# Altium project Do_An_2.PrjPcb
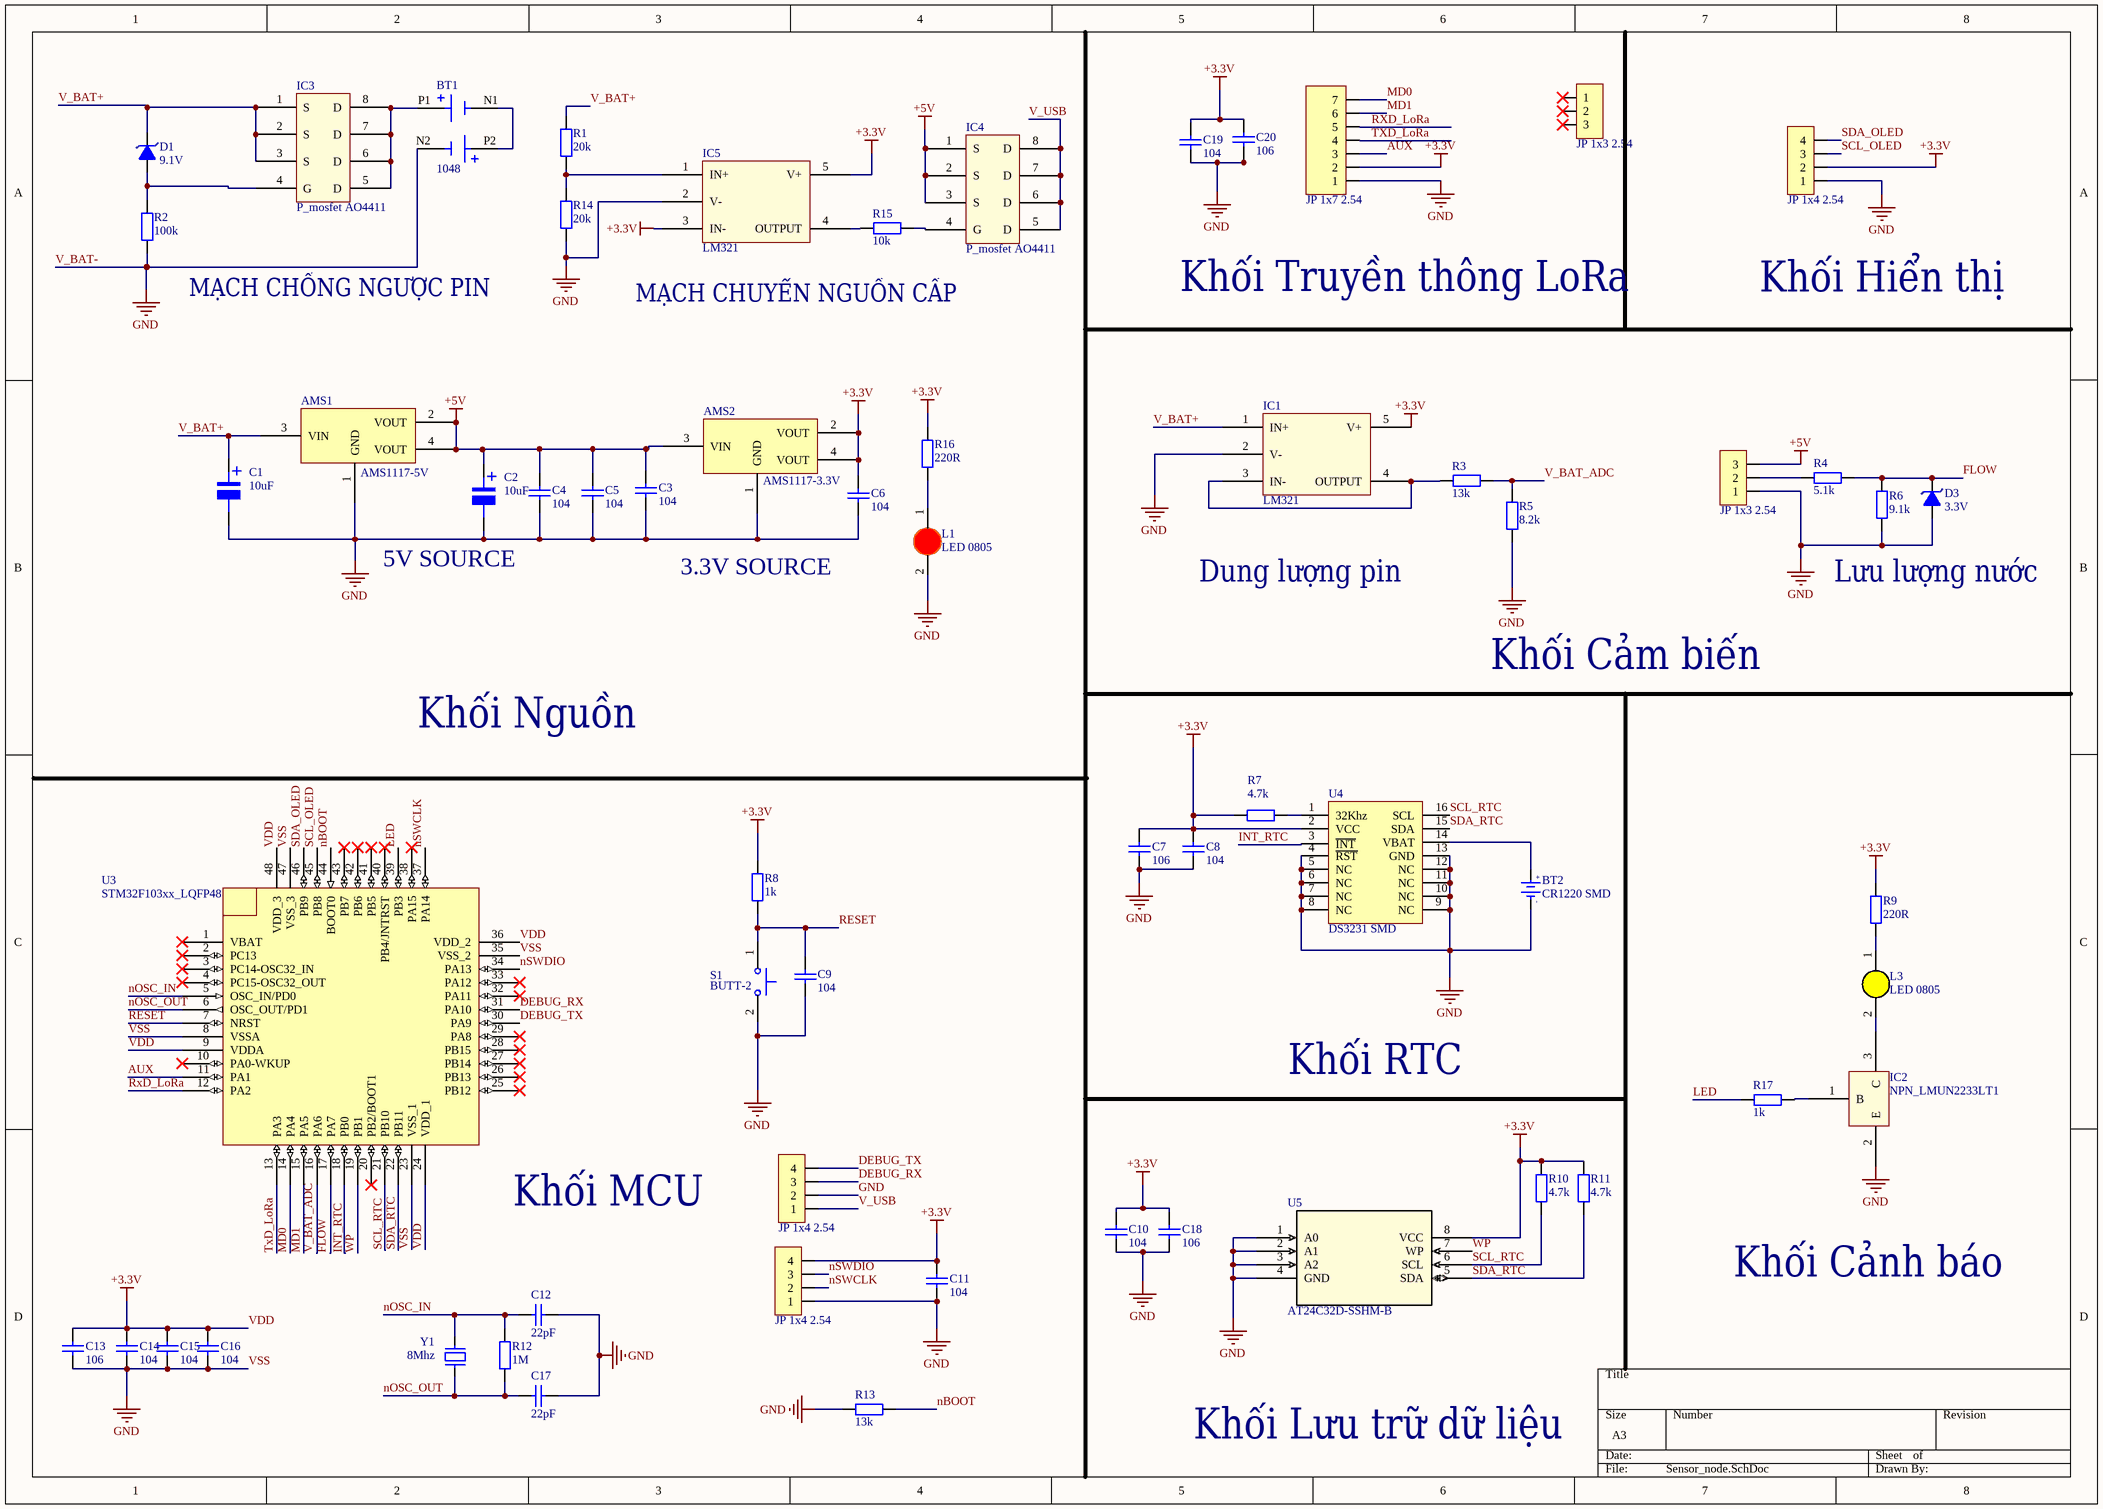
[diagram p0: Sensor_node.SchDoc]
1 sheet, 61 parts. Net scope: global (net labels, ports and power ports of the same name join across sheets).
Board file: Sensor_node.PcbDoc

## Sheet Sensor_node.SchDoc
size A3; SheetNumber: 1; SheetTotal: 1

### Parts
AMS1  AMS1117-5V  [SOT223]
AMS2  AMS1117-3.3V  [SOT223]
BT1  1048  [BAT_1048]
BT2  CR1220 SMD  [DE PIN CR1220]
C1  10uF  [tu nhom 4 (b)]
C2  10uF  [tu nhom 4 (b)]
C3  104  [tu 1206]
C4  104  [tu 1206]
C5  104  [tu 1206]
C6  104  [tu 1206]
C7  106  [tu 1206]
C8  104  [tu 1206]
C9  104  [tu 1206]
C10  104  [tu 1206]
C11  104  [tu 1206]
C12  22pF  [tu 0805]
C13  106  [tu 1206]
C14  104  [tu 1206]
C15  104  [tu 1206]
C16  104  [tu 1206]
C17  22pF  [tu 0805]
C18  106  [tu 1206]
C19  104  [tu 1206]
C20  106  [tu 1206]
D1  9.1V  [DIODE ZENNER SMD SOD80]
D3  3.3V  [DIODE ZENNER SMD SOD80]
IC1  LM321  [SOT23_LM321]
IC2  NPN_LMUN2233LT1  [SOT23_LMUN2233_trans]
IC3  P_mosfet AO4411  [SOIC8_AO4411]
IC4  P_mosfet AO4411  [SOIC8_AO4411]
IC5  LM321  [SOT23_LM321]
JP1  JP 1x7 2.54  [JP 1x7 CT]
JP2  JP 1x3 2.54  [JP 1x3 CT]
JP3  JP 1x4 2.54  [JP 1x4 CT]
JP4  JP 1x3 2.54  [JP 1x3 DC]
JP5  JP 1x4 2.54  [JP 1x4 DC]
JP6  JP 1x4 2.54  [JP 1x4 DC]
L1  LED 0805  [LED-0805-Red]
L3  LED 0805  [LED-0805-Yellow]
R1  20k  [tro smd 1206]
R2  100k  [tro smd 0805]
R3  13k  [tro smd 0805]
R4  5.1k  [tro smd 0805]
R5  8.2k  [tro smd 0805]
R6  9.1k  [tro smd 0805]
R7  4.7k  [tro smd 0805]
R8  1k  [tro smd 0805]
R9  220R  [tro smd 0805]
R10  4.7k  [tro smd 0805]
R11  4.7k  [tro smd 0805]
R12  1M  [tro smd 0805]
R13  13k  [tro smd 0805]
R14  20k  [tro smd 1206]
R15  10k  [tro smd 1206]
R16  220R  [tro smd 0805]
R17  1k  [tro smd 1206]
S1  BUTT-2  [SW_BUTT-2]
U3  STM32F103xx_LQFP48  [STM32_LQPF48]
U4  DS3231 SMD  [SOIC 16]
U5  AT24C32D-SSHM-B  [8S1_ATM]
Y1  8Mhz  [Thach Anh 2 chan SMD]

### Nets
+5V: AMS1.2(VOUT) AMS1.4(VOUT) AMS2.3(VIN) C2.1 C3.1 C4.1 C5.1 IC4.1(S) IC4.2(S) IC4.3(S) JP4.3
GND: AMS1.1(GND) AMS2.1(GND) BT1.N2 BT2.2(GND) C1.2 C2.2 C3.2 C4.2 C5.2 C6.2 C7.1 C8.2 C9.2 C10.2 C11.2 C12.1 C13.1 C14.2 C15.2 C16.2 C17.1 C18.2 C19.2 C20.2 D3.1(A) IC1.2(V-) IC2.2(E) IC5.2(V-) JP1.1 JP3.1 JP4.1 JP5.1 JP6.2 L1.2(K) R2.1 R5.1 R6.1 R13.1 R14.1 S1.2 U3.8(VSSA) U3.23(VSS_1) U3.35(VSS_2) U3.47(VSS_3) U4.4(~{RST}) U4.5(NC) U4.6(NC) U4.7(NC) U4.8(NC) U4.9(NC) U4.10(NC) U4.11(NC) U4.12(NC) U4.13(GND) U5.1(A0) U5.2(A1) U5.3(A2) U5.4(GND)  [also labelled V_BAT-, VSS]
VDD: AMS2.2(VOUT) AMS2.4(VOUT) C6.1 C7.2 C8.1 C10.1 C11.1 C13.2 C14.1 C15.1 C16.1 C18.1 C19.1 C20.1 IC1.5(V+) IC5.3(IN-) IC5.5(V+) JP1.2 JP3.2 JP5.4 R7.2 R8.2 R9.2 R10.2 R11.2 R16.1 U3.9(VDDA) U3.24(VDD_1) U3.36(VDD_2) U3.48(VDD_3) U4.2(VCC) U5.8(VCC)  [also labelled +3.3V]
AUX: JP1.3 U3.11(PA1)
DEBUG_RX: JP6.3 U3.31(PA10)
DEBUG_TX: JP6.4 U3.30(PA9)
FLOW: D3.2(K) R4.2 R6.2 U3.17(PA7)
INT_RTC: U3.18(PB0) U4.3(~{INT})
LED: R17.1 U3.39(PB3)
MD0: JP1.7 U3.14(PA4)
MD1: JP1.6 U3.15(PA5)
nBOOT: R13.2 U3.44(BOOT0)
nOSC_IN: C12.2 R12.2 U3.5(OSC_IN/PD0) Y1.2
nOSC_OUT: C17.2 R12.1 U3.6(OSC_OUT/PD1) Y1.1
nSWCLK: JP5.2 U3.37(PA14)
nSWDIO: JP5.3 U3.34(PA13)
RESET: C9.1 R8.1 S1.1 U3.7(NRST)
RxD_LoRa: JP1.5 U3.12(PA2)
SCL_OLED: JP3.3 U3.45(PB8)
SCL_RTC: R10.1 U3.21(PB10) U4.16(SCL) U5.6(SCL)
SDA_OLED: JP3.4 U3.46(PB9)
SDA_RTC: R11.1 U3.22(PB11) U4.15(SDA) U5.5(SDA)
TxD_LoRa: JP1.4 U3.13(PA3)
V_BAT+: AMS1.3(VIN) C1.1 D1.2(K) IC1.1(IN+) IC3.1(S) IC3.2(S) IC3.3(S) R1.2
V_BAT_ADC: R3.1 R5.2 U3.16(PA6)
V_USB: IC4.5(D) IC4.6(D) IC4.7(D) IC4.8(D) JP6.1
WP: U3.19(PB1) U5.7(WP)
NetBT1_N1: BT1.N1 BT1.P2
NetBT1_P1: BT1.P1 IC3.5(D) IC3.6(D) IC3.7(D) IC3.8(D)
NetBT2_1: BT2.1(+3V) U4.14(VBAT)
NetD1_1: D1.1(A) IC3.4(G) R2.2
NetIC1_3: IC1.3(IN-) IC1.4(OUTPUT) R3.2
NetIC2_1: IC2.1(B) R17.2
NetIC2_3: IC2.3(C) L3.2(K)
NetIC4_4: IC4.4(G) R15.1
NetIC5_1: IC5.1(IN+) R1.1 R14.2
NetIC5_4: IC5.4(OUTPUT) R15.2
NetJP4_2: JP4.2 R4.1
NetL1_1: L1.1(A) R16.2
NetL3_1: L3.1(A) R9.1
NetR7_1: R7.1 U4.1(32Khz)

Not connected (* = marked no-connect by the designer): JP2 1* 2* 3*; U3 1(VBAT)* 2(PC13)* 3(PC14-OSC32_IN)* 4(PC15-OSC32_OUT)* 10(PA0-WKUP)* 20(PB2/BOOT1)* 25(PB12)* 26(PB13)* 27(PB14)* 28(PB15)* 29(PA8)* 32(PA11)* 33(PA12)* 38(PA15)* 40(PB4/JNTRST)* 41(PB5)* 42(PB6)* 43(PB7)*

### Notes on the sheet
- MẠCH CHỐNG NGƯỢC PIN
- MẠCH CHUYỂN NGUỒN CẤP
- Khối Truyền thông LoRa
- Khối Hiển thị
- (near C2) 5V SOURCE
- 3.3V SOURCE
- Dung lượng pin
- Lưu lượng nước
- Khối Cảm biến
- Khối Nguồn
- Khối RTC
- (near U3) Khối MCU
- Khối Cảnh báo
- Khối Lưu trữ dữ liệu
- (in symbol De pin CR1220 SMD) +; -
- (in symbol Tu Nhom 10uF 25V) +

### Library data of the parts
AMS1 AMS2 = AMS1117 SMD: Dán; Value: AMS1117-3.3V SOT223; Don_Vi: Con; Ma_Hang: MH000596; Ghi_Chu: *; Kieu_Chan: *; Chung_Loai: Dán
BT2 = De pin CR1220 SMD: Ten: Đế PIN CR1220 SMD; Ma_Hang: MH000833
C1 C2 = Tu Nhom 10uF 25V: Dán; Don_Vi: Con; So_Chan: 2; Ten_Linh_Kien: Tụ Nhôm 10uF 25V 4x5MM; Ma_Hang: MH002230; Chung_Loai: Dán; Kieu_Chan: *
C3-C6 C8-C11 C14-C16 C19 = Tu 1206 104 50V 20%: Dán; Don_Vi: Con; So_Chan: 2; Ten_Linh_Kien: Tụ 1206 104-0.1uF 20% 50V; Ma_Hang: MH004544; Chung_Loai: Dán; Kieu_Chan: *
C7 C13 C18 C20 = Tu 1206 106 16V 20%: Dán; Don_Vi: Con; So_Chan: 2; Ten_Linh_Kien: Tụ 1206 106-10uF 20% 16V; Ma_Hang: MH004541; Chung_Loai: Dán; Kieu_Chan: *
C12 C17 = Tu 0805 22pF 50V 10%: Dán; Don_Vi: Con; So_Chan: 2; Ten_Linh_Kien: Tụ 0805 22P 10% 50V; Ma_Hang: MH004560; Chung_Loai: Dán; Kieu_Chan: *
D1 = Diode Zener 9.1V: Dán; Don_Vi: Con; Ma_Hang: MH002882; Ten_Linh_Kien: Diode Zener 1/2W 9.1V SMD1206 ZMM9.1; Ghi_Chu: *; Chung_Loai: Dán; Kieu_Chan: *
D3 = Diode Zener 3.3V: Dán; Don_Vi: Con; Ma_Hang: MH002880; Ten_Linh_Kien: Diode Zener 1/2W 3.3V SMD1206 ZMM3.3; Kieu_Chan: *; Ghi_Chu: *; Chung_Loai: Dán
JP1 = JP 1x7 2.54 Cai Thang: Cắm; Ten_Linh_Kien: Jump Đơn Cái 2.54MM 1x20P Thẳng; Don_Vi: Con; Ma_Hang: MH004006; Ghi_Chu: *; Kieu_Chan: *; Chung_Loai: Cắm
JP2 = JP 1x3 2.54 Cai Thang: Cắm; Ten_Linh_Kien: Jump Đơn Cái 2.54MM 1x20P Thẳng; Don_Vi: Con; Ma_Hang: MH004006; Ghi_Chu: *; Kieu_Chan: *; Chung_Loai: Cắm
JP3 = JP 1x4 2.54 Cai Thang: Cắm; Ten_Linh_Kien: Jump Đơn Cái 2.54MM 1x20P Thẳng; Don_Vi: Con; Ma_Hang: MH004006; Ghi_Chu: *; Kieu_Chan: *; Chung_Loai: Cắm
JP4 = JP 1x3 2.54 Duc Cong: Cắm; Ten_Linh_Kien: Jump Đơn Đực 2.54MM 1x40P Cong Đứng; Don_Vi: Con; Ma_Hang: MH000904; Ghi_Chu: *; Kieu_Chan: *; Chung_Loai: Cắm
JP5 JP6 = JP 1x4 2.54 Duc Cong: Cắm; Ten_Linh_Kien: Jump Đơn Đực 2.54MM 1x40P Cong Đứng; Don_Vi: Con; Ma_Hang: MH000904; Ghi_Chu: *; Kieu_Chan: *; Chung_Loai: Cắm
L1 = LED 0805 Do: Dán; Don_Vi: Con; Ma_Hang: MH000897; Ten_Linh_Kien: LED 0805 Màu Đỏ (Red); Ghi_Chu: *; Kieu_Chan: *; Chung_Loai: Dán
L3 = LED 0805 Vang: Dán; Don_Vi: Con; Ma_Hang: MH002329; Ten_Linh_Kien: LED 0805 Màu Vàng ( Yellow); Ghi_Chu: *; Kieu_Chan: *; Chung_Loai: Dán
R1 R14 R15 = Tro 1206 1% 2.2k: Dán; Chung_Loai: Cắm; Don_Vi: Con; So_Chan: 2; Ten_Linh_Kien: Trở 1206 1% 2.2k; Ma_Hang: MH005882; Kieu_Chan: *
R2 = Tro 0805 5% 100k: Dán; Don_Vi: Con; So_Chan: 2; Ten_Linh_Kien: Trở 0805 5% 100k; Ma_Hang: MH005250; Chung_Loai: Dán; Kieu_Chan: *
R3 R4 R6 R13 = Tro 0805 5% 12k: Dán; Don_Vi: Con; So_Chan: 2; Ten_Linh_Kien: Trở 0805 5% 12k; Ma_Hang: MH005241; Chung_Loai: Dán; Kieu_Chan: *
R5 = Tro 0805 5% 8.2k: Dán; Don_Vi: Con; So_Chan: 2; Ten_Linh_Kien: Trở 0805 5% 8.2k; Ma_Hang: MH005312; Chung_Loai: Dán; Kieu_Chan: *
R7 R10 R11 = Tro 0805 5% 4.7k: Dán; Don_Vi: Con; So_Chan: 2; Ten_Linh_Kien: Trở 0805 5% 4.7k; Ma_Hang: MH005307; Chung_Loai: Dán; Kieu_Chan: *
R8 = Tro 0805 5% 1k: Dán; Don_Vi: Con; So_Chan: 2; Ten_Linh_Kien: Trở 0805 5% 1k; Ma_Hang: MH005234; Chung_Loai: Dán; Kieu_Chan: *
R9 = Tro 0805 5% 220R: Dán; Don_Vi: Con; So_Chan: 2; Ten_Linh_Kien: Trở 0805 5% 220R; Ma_Hang: MH005259; Chung_Loai: Dán; Kieu_Chan: *
R12 = Tro 0805 1% 1M: Dán; Don_Vi: Con; So_Chan: 2; Ten_Linh_Kien: Trở 0805 1% 1M; Ma_Hang: MH005469; Chung_Loai: Dán; Kieu_Chan: *
R16 = Tro 0805 1% 0.5R: Dán; Don_Vi: Con; So_Chan: 2; Ten_Linh_Kien: Trở 0805 1% 0.5R; Ma_Hang: MH005465; Chung_Loai: Dán; Kieu_Chan: *
R17 = Tro 1206 1% 1k: Dán; Don_Vi: Con; So_Chan: 2; Ten_Linh_Kien: Trở 1206 1% 1k; Ma_Hang: MH005880; Chung_Loai: Dán; Kieu_Chan: *
S1 = BUTT-2: Tactile Switches MINI PUSH BUTTON SWITCH 2-PIN QTY. 4; MF: Gravitech; Purchase-URL: https://pricing.snapeda.com/search/part/BUTT-2/?ref=eda; Package: None; Value: *; Check_prices: https://www.snapeda.com/parts/BUTT-2/Gravitech/view-part/?ref=eda; SnapEDA_Link: https://www.snapeda.com/parts/BUTT-2/Gravitech/view-part/?ref=snap; Availability: In Stock; Price: None; MP: BUTT-2
U4 = DS3231 SMD: SOIC
U5 = AT24C32D-SSHM-B: No Description Available; Mfr_Name: Microchip; RefDes: RefDes; Type: Type
Y1 = Thach Anh 2 chan SMD: Crystal For all Crystal 2pin.; Value: 4Mhz
BT1 = 1048: Price: None; Value: *; Package: None; Availability: Unavailable; MP: 1048
U3 = STM32F103xx_LQFP48: Published: 30-May-2008; DatasheetVersion: rev6, Mar-2008; PackageVersion: Mar-2008; PackageReference: LQFP48; Publisher: Altium Limited; PackageDescription: 48-Pin Low-Profile Quad Flat Pack, 7 x 7 mm Body, 0.5 mm Pitch (LQFP48); ComponentLink1Description: Manufacturer Link; ComponentLink1URL: www.st.com/stm32; ComponentLink2Description: Datasheet; ComponentLink2URL: http://www.st.com/stonline/products/literature/ds/13587.pdf